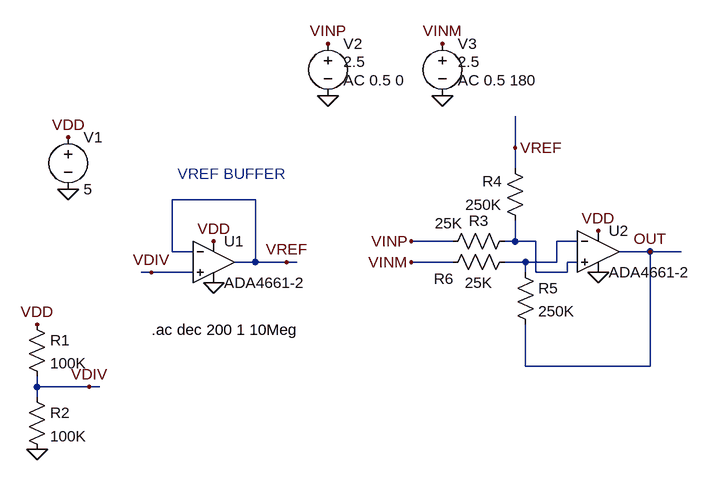
[diagram p0: schematic Draft1.asc]
Draft1.asc, the LTspice schematic file:
Version 4.1
SHEET 1 984 680
WIRE 704 -32 704 -80
WIRE 704 0 704 -32
WIRE 304 48 176 48
WIRE 608 112 544 112
WIRE 704 112 704 80
WIRE 704 112 688 112
WIRE 736 112 704 112
WIRE 800 112 768 112
WIRE 176 128 176 48
WIRE 208 128 176 128
WIRE 912 128 864 128
WIRE 960 128 912 128
WIRE 304 144 304 48
WIRE 304 144 272 144
WIRE 352 144 304 144
WIRE 368 144 352 144
WIRE 608 144 544 144
WIRE 720 144 688 144
WIRE 768 144 768 112
WIRE 768 144 720 144
WIRE 800 144 784 144
WIRE 144 160 128 160
WIRE 208 160 144 160
WIRE 720 160 720 144
WIRE 736 160 736 112
WIRE 784 160 784 144
WIRE 784 160 736 160
WIRE 720 304 720 240
WIRE 912 304 912 128
WIRE 912 304 720 304
WIRE -32 336 -32 320
WIRE 48 336 -32 336
WIRE 64 336 48 336
WIRE -32 352 -32 336
FLAG 240 176 0
FLAG 16 32 0
FLAG 16 -48 VDD
FLAG 240 112 VDD
FLAG -32 432 0
FLAG -32 240 VDD
FLAG 48 336 VDIV
FLAG 144 160 VDIV
FLAG 352 144 VREF
FLAG 832 160 0
FLAG 832 96 VDD
FLAG 704 -32 VREF
FLAG 912 128 OUT
FLAG 544 112 VINP
FLAG 544 144 VINM
FLAG 416 -192 VINP
FLAG 592 -192 VINM
FLAG 416 -112 0
FLAG 592 -112 0
SYMBOL OpAmps\\ADA4661-2 240 80 R0
SYMATTR InstName U1
SYMBOL voltage 16 -64 R0
WINDOW 123 0 0 Left 0
WINDOW 39 0 0 Left 0
SYMATTR InstName V1
SYMATTR Value 5
SYMBOL res -48 224 R0
SYMATTR InstName R1
SYMATTR Value 100K
SYMBOL res -48 336 R0
SYMATTR InstName R2
SYMATTR Value 100K
SYMBOL OpAmps\\ADA4661-2 832 64 R0
SYMATTR InstName U2
SYMBOL res 704 96 R90
WINDOW 0 0 56 VBottom 2
WINDOW 3 -27 102 VTop 2
SYMATTR InstName R3
SYMATTR Value 25K
SYMBOL res 720 96 R180
WINDOW 0 36 76 Left 2
WINDOW 3 36 40 Left 2
SYMATTR InstName R4
SYMATTR Value 250K
SYMBOL res 704 144 R0
SYMATTR InstName R5
SYMATTR Value 250K
SYMBOL res 704 128 R90
WINDOW 0 57 110 VBottom 2
WINDOW 3 32 56 VTop 2
SYMATTR InstName R6
SYMATTR Value 25K
SYMBOL voltage 416 -208 R0
WINDOW 3 24 44 Left 2
WINDOW 123 24 72 Left 2
WINDOW 39 0 0 Left 0
SYMATTR Value 2.5
SYMATTR Value2 AC 0.5 0
SYMATTR InstName V2
SYMBOL voltage 592 -208 R0
WINDOW 3 24 44 Left 2
WINDOW 123 24 72 Left 2
WINDOW 39 0 0 Left 0
SYMATTR Value 2.5
SYMATTR Value2 AC 0.5 180
SYMATTR InstName V3
TEXT 184 8 Left 2 ;VREF BUFFER
TEXT 144 248 Left 2 !.ac dec 200 1 10Meg

The netlist it stands for:
* Draft1.asc
X§U1 VDIV VREF VDD 0 VREF ADA4661-2  ; pins In+ In- V+ V- OUT
V1 VDD 0 5
R1 VDD VDIV 100K
R2 VDIV 0 100K
X§U2 N001 N002 VDD 0 OUT ADA4661-2  ; pins In+ In- V+ V- OUT
R3 N001 VINP 25K
R4 N001 VREF 250K
R5 N002 OUT 250K
R6 N002 VINM 25K
V2 VINP 0 2.5 AC 0.5 0
V3 VINM 0 2.5 AC 0.5 180
* VREF BUFFER
.ac dec 200 1 10Meg
.lib ADI1.lib
.backanno
.end